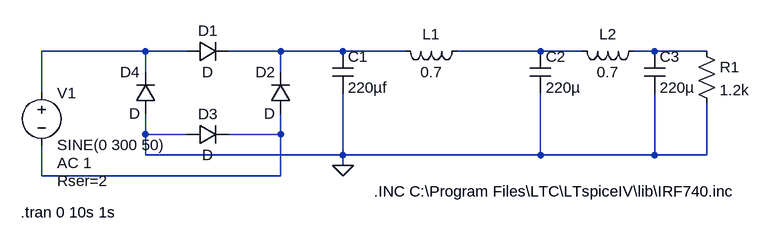
[diagram p0: schematic Napajanje.asc]
Napajanje.asc, the LTspice schematic file:
Version 4
SHEET 1 984 680
WIRE -32 -16 -192 -16
WIRE 32 -16 -32 -16
WIRE 176 -16 96 -16
WIRE 272 -16 176 -16
WIRE 368 -16 272 -16
WIRE 576 -16 448 -16
WIRE 640 -16 576 -16
WIRE 752 -16 720 -16
WIRE 832 -16 752 -16
WIRE -32 16 -32 -16
WIRE 176 16 176 -16
WIRE -192 48 -192 -16
WIRE -32 112 -32 80
WIRE 32 112 -32 112
WIRE 176 112 176 80
WIRE 176 112 96 112
WIRE -32 144 -32 112
WIRE 272 144 272 48
WIRE 272 144 -32 144
WIRE 576 144 576 48
WIRE 576 144 272 144
WIRE 752 144 752 48
WIRE 752 144 576 144
WIRE 832 144 832 64
WIRE 832 144 752 144
WIRE 272 160 272 144
WIRE -192 176 -192 128
WIRE 176 176 176 112
WIRE 176 176 -192 176
FLAG 272 160 0
SYMBOL voltage -192 32 R0
WINDOW 123 24 124 Left 2
WINDOW 39 24 152 Left 2
SYMATTR Value2 AC 1
SYMATTR SpiceLine Rser=2
SYMATTR InstName V1
SYMATTR Value SINE(0 300 50)
SYMBOL diode 32 0 R270
WINDOW 0 32 32 VTop 2
WINDOW 3 0 32 VBottom 2
SYMATTR InstName D1
SYMBOL diode 192 80 R180
WINDOW 0 24 64 Left 2
WINDOW 3 24 0 Left 2
SYMATTR InstName D2
SYMBOL diode 32 128 R270
WINDOW 0 32 32 VTop 2
WINDOW 3 0 32 VBottom 2
SYMATTR InstName D3
SYMBOL diode -16 80 R180
WINDOW 0 24 64 Left 2
WINDOW 3 24 0 Left 2
SYMATTR InstName D4
SYMBOL cap 256 -16 R0
SYMATTR InstName C1
SYMATTR Value 220µf
SYMBOL res 816 -32 R0
SYMATTR InstName R1
SYMATTR Value 1.2k
SYMBOL cap 560 -16 R0
SYMATTR InstName C2
SYMATTR Value 220µ
SYMBOL cap 736 -16 R0
SYMATTR InstName C3
SYMATTR Value 220µ
SYMBOL ind 464 -32 R90
WINDOW 0 5 56 VBottom 2
WINDOW 3 32 56 VTop 2
SYMATTR InstName L1
SYMATTR Value 0.7
SYMBOL ind 736 -32 R90
WINDOW 0 5 56 VBottom 2
WINDOW 3 32 56 VTop 2
SYMATTR InstName L2
SYMATTR Value 0.7
TEXT -224 232 Left 2 !.tran 0 10s 1s
TEXT 320 200 Left 2 !.INC C:\\Program Files\\LTC\\LTspiceIV\\lib\\IRF740.inc

The netlist it stands for:
* Napajanje.asc
V1 N001 N005 SINE(0 300 50) AC 1 Rser=2
D1 N001 N002 D
D2 N005 N002 D
D3 0 N005 D
D4 0 N001 D
C1 N002 0 220µf
R1 N004 0 1.2k
C2 N003 0 220µ
C3 N004 0 220µ
L1 N003 N002 0.7
L2 N004 N003 0.7
.model D D
.lib standard.dio
.tran 0 10s 1s
.INC C:\Program Files\LTC\LTspiceIV\lib\IRF740.inc
.backanno
.end